# Altium project ARM_EURO_Platine.PrjPCB
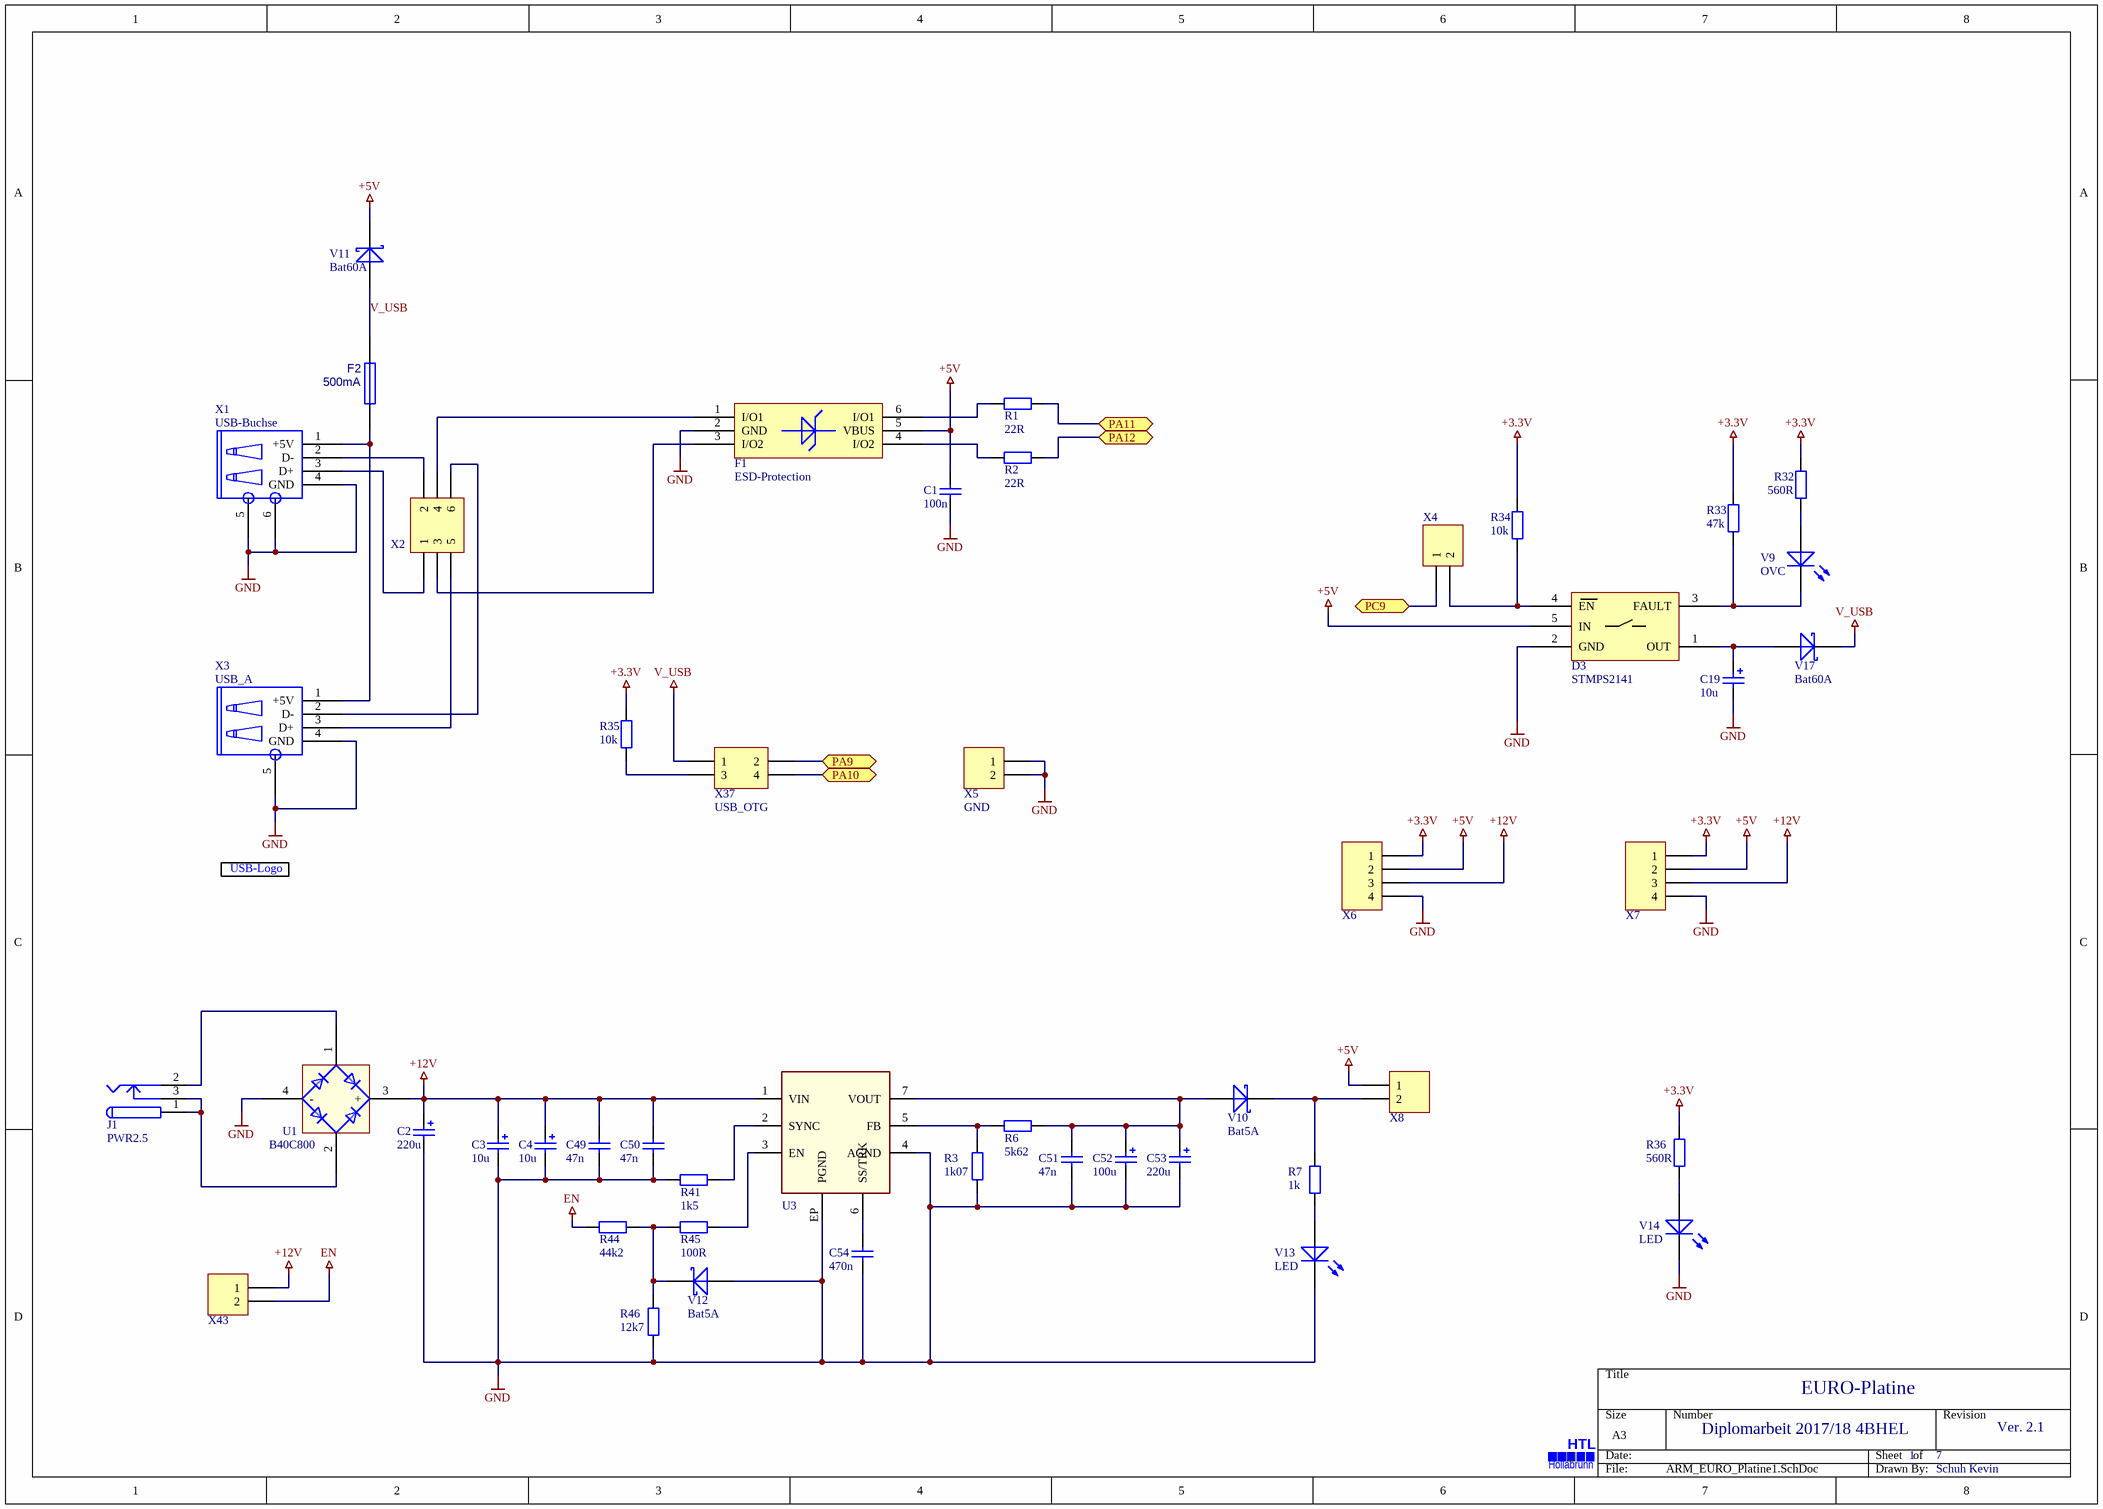
[diagram p0: ARM_EURO_Platine1.SchDoc]
7 sheets, 194 parts. Net scope: flat (ports and power ports of the same name join across sheets).
Board files: ARM_EURO_Platine.PcbDoc, PCB1.PcbDoc, PCB2.PcbDoc
Sheets:
  ARM_EURO_Platine1.SchDoc
  ARM_EURO_Platine2.SchDoc
  ARM_EURO_Platine3.SchDoc
  ARM_EURO_Platine4.SchDoc
  ARM_EURO_Platine5.SchDoc
  ARM_EURO_Platine6.SchDoc
  ARM_EURO_Platine7.SchDoc

## Sheet ARM_EURO_Platine1.SchDoc
size A3; PageSetup: Record=PageOptions|CenterHorizontal=True|CenterVertical=True|PrintScale=0.73|XCorrection=1.00|YCorrection=1.00|PrintKind=0|BorderSize=5000000|LeftOffset=0|BottomOffset=0|Orientation=2|PaperLength=1000|PaperWidth=1000|Scale=100|PaperSource=7|PrintQuality=-3|MediaType=1|DitherType=10|PrintScaleMode=1|PaperKind=A4|PaperIndex=9

### Parts
*1  USB_Logo  [USB_Logo]  (value not drawn)
A1  HTL Hollabrunn  [HTL_Logo]  (value not drawn)
C1  value 100n  [0805_CAP]  (hidden comment: Cap_Keramik_SMD)
C2  value 220u  [100µF_16V_Kondensator]  (hidden comment: Cap_Pol_SMD)
C3  value 10u  [1411_Cap_Pol_Tantal]  (hidden comment: Cap_Pol_Tantal)
C4  value 10u  [1411_Cap_Pol_Tantal]  (hidden comment: Cap_Pol_Tantal)
C19  value 10u  [100µF_16V_Kondensator]  (hidden comment: Cap_Pol_SMD)
C49  value 47n  [0805_CAP]  (hidden comment: Cap_Keramik_SMD)
C50  value 47n  [0805_CAP]  (hidden comment: Cap_Keramik_SMD)
C51  value 47n  [0805_CAP]  (hidden comment: Cap_Keramik_SMD)
C52  value 100u  [100µF_16V_Kondensator]  (hidden comment: Cap_Pol_SMD)
C53  value 220u  [100µF_16V_Kondensator]  (hidden comment: Cap_Pol_SMD)
C54  value 470n  [0805_CAP]  (hidden comment: Cap_Keramik_SMD)
D3  STMPS2141  [STMPS2141]
F1  ESD-Protection  [USBLC6_2]
F2  500mA  [Polyfuse]
J1  PWR2.5  [PowerJack]
R1  value 22R  [0805_Res]  (hidden comment: Res_SMD)
R2  value 22R  [0805_Res]  (hidden comment: Res_SMD)
R3  value 1k07  [0805_Res]  (hidden comment: Res_SMD)
R6  value 5k62  [0805_Res]  (hidden comment: Res_SMD)
R7  value 1k  [0805_Res]  (hidden comment: Res_SMD)
R32  value 560R  [0805_Res]  (hidden comment: Res_SMD)
R33  value 47k  [0805_Res]  (hidden comment: Res_SMD)
R34  value 10k  [0805_Res]  (hidden comment: Res_SMD)
R35  value 10k  [0805_Res]  (hidden comment: Res_SMD)
R36  value 560R  [0805_Res]  (hidden comment: Res_SMD)
R41  value 1k5  [0805_Res]  (hidden comment: Res_SMD)
R44  value 44k2  [0805_Res]  (hidden comment: Res_SMD)
R45  value 100R  [0805_Res]  (hidden comment: Res_SMD)
R46  value 12k7  [0805_Res]  (hidden comment: Res_SMD)
U1  B40C800  [Diodengleichrichter]
U3  171050601  [TO263-7EP]  (value not drawn)
V9  OVC  [0805_LED]
V10  Bat5A  [BAT254_Schottky]
V11  Bat60A  [BAT254_Schottky]
V12  Bat5A  [BAT254_Schottky]
V13  LED  [0805_LED]
V14  LED  [0805_LED]
V17  Bat60A  [BAT254_Schottky]
X1  USB-Buchse  [USB_B]
X2  Header_3x2  [HDR2X3]  (value not drawn)
X3  USB_A  [USB_A]
X4  Header  [HDR1X2]  (value not drawn)
X5  GND  [HDR1X2]
X6  Header_4  [HDR1X4]  (value not drawn)
X7  Header_4  [HDR1X4]  (value not drawn)
X8  Header  [HDR1X2]  (value not drawn)
X37  USB_OTG  [HDR2X2]
X43  Header  [HDR1X2]  (value not drawn)

### Ports
PA9, PA10, PA11, PA12, PC9

### Nets
+3.3V: R32.2 R33.2 R34.2 R35.2 R36.2 X6.1 X7.1
+5V: C1.2 D3.5(IN) F1.5(VBUS) V11.1 X6.2 X7.2 X8.1
+12V: C2.1 C3.1 C4.1 C49.2 C50.1 U1.3(+) U3.1(VIN) X6.3 X7.3 X43.1
EN: R44.2 X43.2
GND: C1.1 C2.2 C3.2 C4.2 C19.2 C49.1 C50.2 C51.2 C52.2 C53.2 C54.2 D3.2(GND) F1.2(GND) R3.1 R41.2 R46.1 U1.4(-) U3.4(AGND) U3.EP(PGND) V12.2 V13.2(K) V14.2(K) X1.4(GND) X1.5(GND) X1.6(GND) X3.4(GND) X3.5(GND) X5.1 X5.2 X6.4 X7.4
V_USB: F2.2 V11.2 V17.1 X37.1
NetC19_1: C19.1 D3.1(OUT) V17.2
NetC20_2: X37.4 ; port PA10
NetC22_2: X37.2 ; port PA9
NetC51_1: C51.1 C52.1 C53.1 R6.1 U3.7(VOUT) V10.2
NetC54_1: C54.1 U3.6(SS/TRK)
NetD3_3: D3.3(FAULT) R33.1 V9.2(K)
NetD3_4: D3.4(EN) R34.1 X4.2
NetF1_1: F1.1(I/O1) X2.4
NetF1_3: F1.3(I/O2) X2.3
NetF1_4: F1.4(I/O2) R2.1
NetF1_6: F1.6(I/O1) R1.1
NetF2_1: F2.1 X1.1(+5V) X3.1(+5V)
NetJ1_1: J1.1 J1.3 U1.2
NetJ1_2: J1.2 U1.1
NetR1_2: R1.2 ; port PA11
NetR2_2: R2.2 ; port PA12
NetR3_2: R3.2 R6.2 U3.5(FB)
NetR7_1: R7.1 V13.1(A)
NetR7_2: R7.2 V10.1 X8.2
NetR27_2: X4.1 ; port PC9
NetR32_1: R32.1 V9.1(A)
NetR35_1: R35.1 X37.3
NetR36_1: R36.1 V14.1(A)
NetR41_1: R41.1 U3.2(SYNC)
NetR44_1: R44.1 R45.2 R46.2 V12.1
NetR45_1: R45.1 U3.3(EN)
NetX1_2: X1.2(D-) X2.2
NetX1_3: X1.3(D+) X2.1
NetX2_5: X2.5 X3.3(D+)
NetX2_6: X2.6 X3.2(D-)

### Notes on the sheet
- EURO-Platine
- Diplomarbeit 2017/18 4BHEL
- 1
- 7
- Ver. 2.1
- Schuh Kevin
- (in symbol HTL_Logo) HTL; Hollabrunn
- (in symbol USB_Logo) USB-Logo

### Library data of the parts
*1 = USB_Logo: Logo
A1 = HTL_Logo
C1 C49-C51 C54 = Cap_Keramik_SMD: Capacitor_SMD; Published: 8-Jun-2000; LatestRevisionDate: 17-Jul-2002; LatestRevisionNote: Re-released for DXP Platform.; PackageReference: RAD-0.3; Publisher: Altium Limited
C2 C19 C52 C53 = Cap_Pol_SMD: Polarized Capacitor SMD; Published: 8-Jun-2000; LatestRevisionDate: 17-Jul-2002; LatestRevisionNote: Re-released for DXP Platform.; PackageReference: RB7.6-15; Publisher: Altium Limited
C3 C4 = Cap_Pol_Tantal: Polarized Capacitor; Published: 8-Jun-2000; LatestRevisionDate: 17-Jul-2002; LatestRevisionNote: Re-released for DXP Platform.; PackageReference: RB7.6-15; Publisher: Altium Limited
D3 = STMPS2141: Power Switch
F1 = USBLC6_2: Schutz vor entladungen über USB-Buchse
F2 = Fuse: Published: 8-Jun-2000; LatestRevisionDate: 17-Jul-2002; LatestRevisionNote: Re-released for DXP Platform.; PackageReference: PIN-W2/E2.8; Publisher: Altium Limited
J1 = PWR2.5: Low Voltage Power Supply Connector; Published: 17-Dec-2003; DatasheetDocument: 09-May-2002; Publisher: Altium Limited; ComponentLink1Description: Manufacturer Link; ComponentLink1URL: http://domino.kycon.com/internet/Products.html
R1-R3 R6 R7 R32-R36 R41 R44-R46 = Res_SMD: Resistor; Published: 8-Jun-2000; LatestRevisionDate: 17-Jul-2002; LatestRevisionNote: Re-released for DXP Platform.; PackageReference: AXIAL-0.4; Publisher: Altium Limited
U1 = Brueckengleichrichter
U3 = 171050601: VDRM Variable Step Down Regulator Module, TO263-7EP; OutputCurrent: 5A; InputVoltage: 6-36 V(DC); PublishedDate: Aug 2016; Publisher: Wurth Elektronik; ComponentLink1Description: Manufacturer; ComponentLink1URL: http://www.we-online.de; ComponentLink2Description: Datasheet; ComponentLink2URL: http://katalog.we-online.de/pm/datasheet/171050601.pdf; PartNumber: 171050601; Size: TO263-7EP
V9 V13 V14 = LED_SMD: Typical RED, GREEN, YELLOW, AMBER GaAs LED; Published: 8-Jun-2000; LatestRevisionDate: 17-Jul-2002; LatestRevisionNote: Re-released for DXP Platform.; PackageDocument: Feb-2002; PackageReference: 3.2X1.6X1.1; Publisher: Altium Limited
V10-V12 V17 = Bat60A: Diode
X1 = USB_Buchse_B: USB Buchse (B)
X2 = Header_3x2: Header, 3x2-Pin; LatestRevisionDate: 17-Jul-2002; LatestRevisionNote: Re-released for DXP Platform.; Publisher: Altium Limited
X3 = USB_Buchse_A: USB Buchse (A)
X4 X8 X43 = Header_2: Header, 2-Pin; LatestRevisionDate: 17-Jul-2002; LatestRevisionNote: Re-released for DXP Platform.; Publisher: Altium Limited
X5 = Masseschleife: Header, 2-Pin; LatestRevisionDate: 17-Jul-2002; LatestRevisionNote: Re-released for DXP Platform.; Publisher: Altium Limited
X6 X7 = Header_4: Header, 3-Pin; LatestRevisionDate: 17-Jul-2002; LatestRevisionNote: Re-released for DXP Platform.; Publisher: Altium Limited
X37 = Header_2x2: Header, 3x2-Pin; LatestRevisionDate: 17-Jul-2002; LatestRevisionNote: Re-released for DXP Platform.; Publisher: Altium Limited

## Sheet ARM_EURO_Platine2.SchDoc
size A4; PageSetup: Record=PageOptions|CenterHorizontal=True|CenterVertical=True|PrintScale=1.00|XCorrection=1.00|YCorrection=1.00|PrintKind=0|BorderSize=5000000|LeftOffset=0|BottomOffset=0|Orientation=2|PaperLength=1000|PaperWidth=1000|Scale=100|PaperSource=7|PrintQuality=-3|MediaType=1|DitherType=10|PrintScaleMode=1|PaperKind=A4|PaperIndex=9
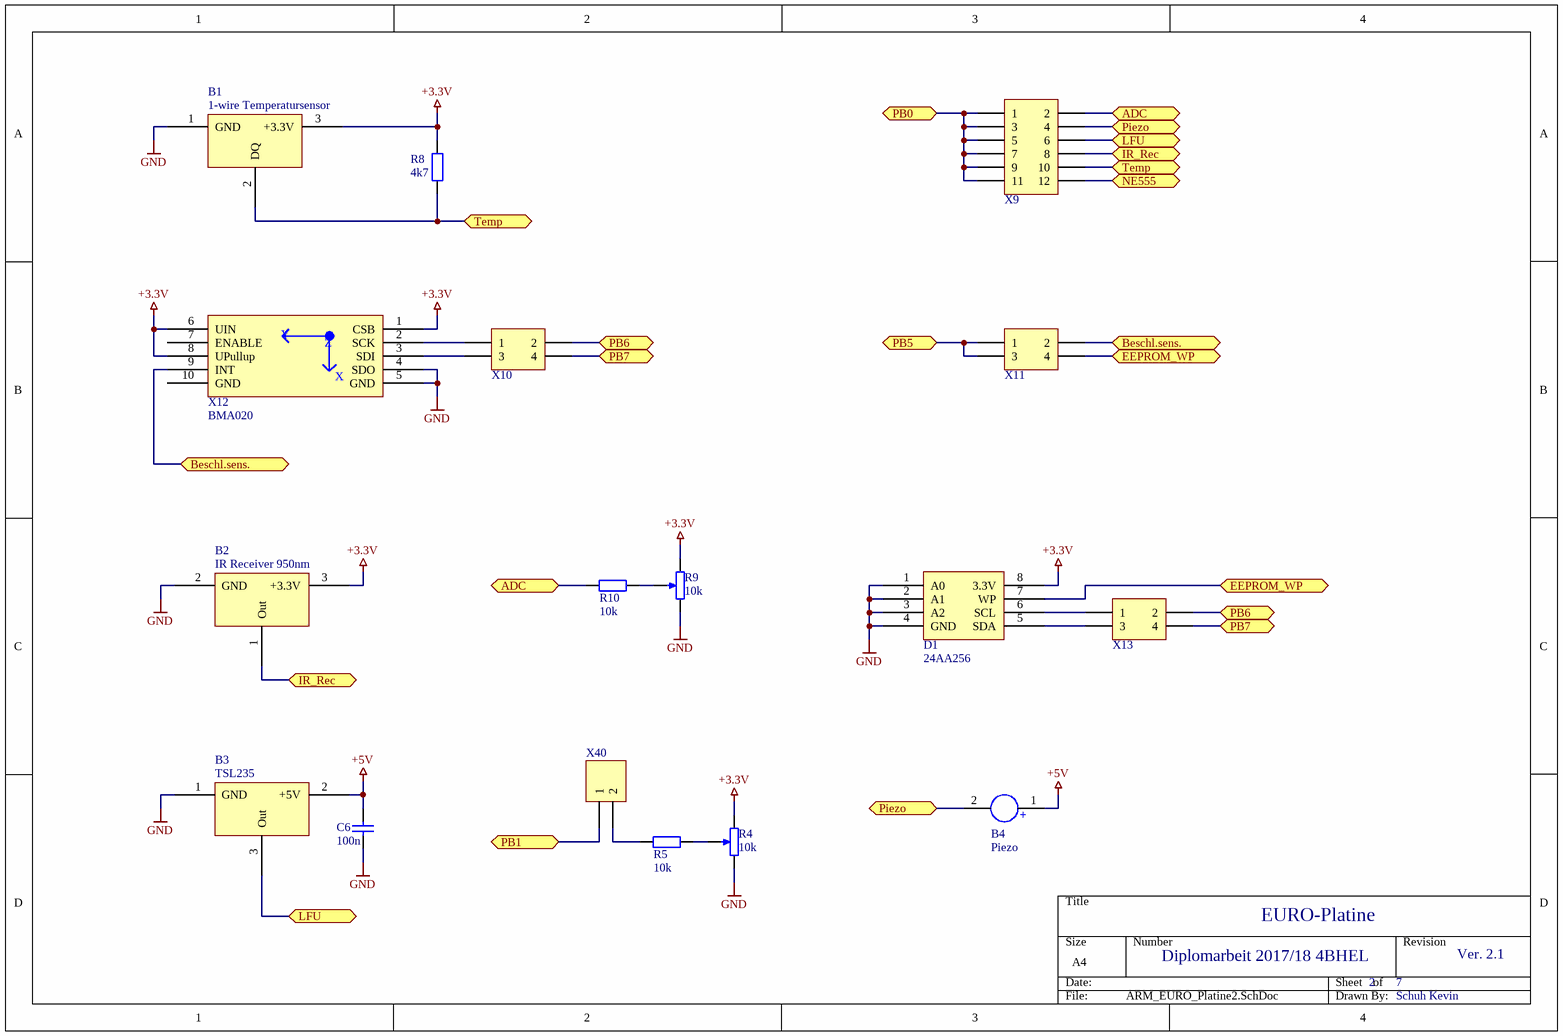
[diagram p1: ARM_EURO_Platine2.SchDoc]

### Parts
B1  1-wire Temperatursensor  [TO_92]
B2  IR Receiver 950nm  [TSOP341]
B3  TSL235  [LFU]
B4  Piezo  [Piezo]
C6  value 100n  [0805_CAP]  (hidden comment: Cap_Keramik_SMD)
D1  24AA256  [PDIP8]
R4  value 10k  [Potentiometer]  (hidden comment: RPot)
R5  value 10k  [0805_Res]  (hidden comment: Res_SMD)
R8  value 4k7  [0805_Res]  (hidden comment: Res_SMD)
R9  value 10k  [Potentiometer]  (hidden comment: RPot)
R10  value 10k  [0805_Res]  (hidden comment: Res_SMD)
X9  Header 6X2A  [HDR2X6]  (value not drawn)
X10  Header_2x2  [HDR2X2]  (value not drawn)
X11  Header_2x2  [HDR2X2]  (value not drawn)
X12  BMA020  [Beschleunigungssensor]
X13  Header_2x2  [HDR2X2]  (value not drawn)
X40  Header  [HDR1X2]  (value not drawn)

### Ports
ADC, Beschl.sens., EEPROM_WP, IR_Rec, LFU, NE555, PB0, PB1, PB5, PB6, PB7, Piezo, Temp

### Nets
+3.3V: B1.3(+3.3V) B2.3(+3.3V) D1.8(3.3V) R4.1(TOP) R8.2 R9.1(TOP) X12.1(CSB) X12.6(UIN) X12.8(UPullup)
+5V: B3.2(+5V) B4.1 C6.2
GND: B1.1(GND) B2.2(GND) B3.1(GND) C6.1 D1.1(A0) D1.2(A1) D1.3(A2) D1.4(GND) R4.2(BOT) R9.2(BOT) X12.4(SDO) X12.5(GND)
NetB1_2: B1.2(DQ) R8.1 X9.10 ; port Temp
NetB2_1: B2.1(Out) X9.8 ; port IR_Rec
NetB3_3: B3.3(Out) X9.6 ; port LFU
NetB4_2: B4.2 X9.4 ; port Piezo
NetD1_5: D1.5(SDA) X13.3
NetD1_6: D1.6(SCL) X13.1
NetD1_7: D1.7(WP) X11.4 ; port EEPROM_WP
NetD2_3: X9.12 ; port NE555
NetD4_9: X10.4 X13.4 ; port PB7
NetD4_11: X10.2 X13.2 ; port PB6
NetR4_3: R4.3(TAP) R5.1
NetR5_2: R5.2 X40.2
NetR9_3: R9.3(TAP) R10.1
NetR10_2: R10.2 X9.2 ; port ADC
NetX9_1: X9.1 X9.3 X9.5 X9.7 X9.9 X9.11 ; port PB0
NetX10_1: X10.1 X12.2(SCK)
NetX10_3: X10.3 X12.3(SDI)
NetX11_1: X11.1 X11.3 ; port PB5
NetX11_2: X11.2 X12.9(INT) ; port Beschl.sens.
NetX20_32: X40.1 ; port PB1

Not connected (* = marked no-connect by the designer): X12 7(ENABLE) 10(GND)

### Notes on the sheet
- EURO-Platine
- Diplomarbeit 2017/18 4BHEL
- 2
- 7
- Ver. 2.1
- Schuh Kevin
- (in symbol Beschleunigungssensor) Y; Z; X
- (in symbol Piezo) +

### Library data of the parts
B1 = DS18B20: Temperatursensor
B2 = IR_Receiver: IR-Empfänger; Anbieter: Farnell
B3 = LFU: Licht/Frequenz - Umwandler
B4 = Piezo: Signalgeber
C6 = Cap_Keramik_SMD: Capacitor_SMD; Published: 8-Jun-2000; LatestRevisionDate: 17-Jul-2002; LatestRevisionNote: Re-released for DXP Platform.; PackageReference: RAD-0.3; Publisher: Altium Limited
D1 = EEPROM: 32kx8 EEPROM
R4 R9 = RPot: Potentiometer; Sim Note: Enter the Resistance value and the set point into parameter fields.; Set Position: 0.5; Published: 8-Jun-2000; LatestRevisionDate: 17-Jul-2002; LatestRevisionNote: Re-released for DXP Platform.; PackageReference: VR5; Publisher: Altium Limited
R5 R8 R10 = Res_SMD: Resistor; Published: 8-Jun-2000; LatestRevisionDate: 17-Jul-2002; LatestRevisionNote: Re-released for DXP Platform.; PackageReference: AXIAL-0.4; Publisher: Altium Limited
X9 = Header_6X2A: Header, 6-Pin, Dual row; LatestRevisionDate: 17-Jul-2002; LatestRevisionNote: Re-released for DXP Platform.; Publisher: Altium Limited
X10 X11 X13 = Header_2x2: Header, 3x2-Pin; LatestRevisionDate: 17-Jul-2002; LatestRevisionNote: Re-released for DXP Platform.; Publisher: Altium Limited
X12 = Beschleunigungssensor: 3-Achsen Beschleunigungssensor-Modul; Hersteller: ELV Electronics
X40 = Header_2: Header, 2-Pin; LatestRevisionDate: 17-Jul-2002; LatestRevisionNote: Re-released for DXP Platform.; Publisher: Altium Limited

## Sheet ARM_EURO_Platine3.SchDoc
size A4; PageSetup: Record=PageOptions|CenterHorizontal=True|CenterVertical=True|PrintScale=1.00|XCorrection=1.00|YCorrection=1.00|PrintKind=0|BorderSize=5000000|LeftOffset=0|BottomOffset=0|Orientation=2|PaperLength=1000|PaperWidth=1000|Scale=100|PaperSource=7|PrintQuality=-3|MediaType=1|DitherType=10|PrintScaleMode=1|PaperKind=A4|PaperIndex=9
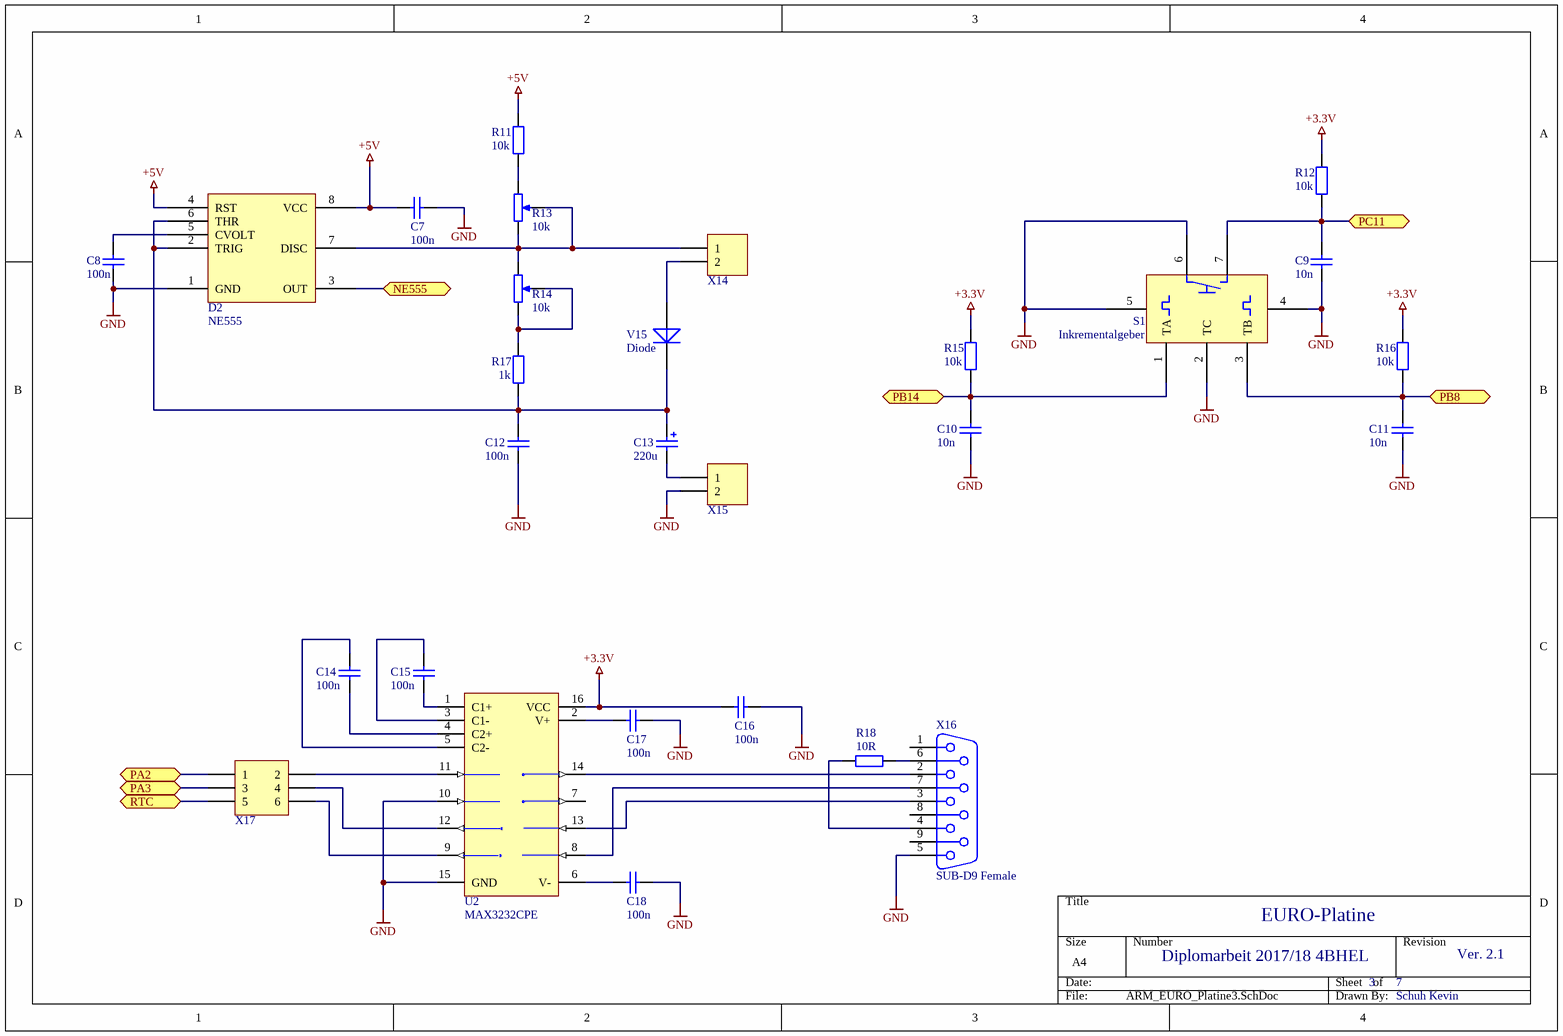
[diagram p2: ARM_EURO_Platine3.SchDoc]

### Parts
C7  value 100n  [0805_CAP]  (hidden comment: Cap_Keramik_SMD)
C8  value 100n  [0805_CAP]  (hidden comment: Cap_Keramik_SMD)
C9  value 10n  [0805_CAP]  (hidden comment: Cap_Keramik_SMD)
C10  value 10n  [0805_CAP]  (hidden comment: Cap_Keramik_SMD)
C11  value 10n  [0805_CAP]  (hidden comment: Cap_Keramik_SMD)
C12  value 100n  [0805_CAP]  (hidden comment: Cap_Keramik_SMD)
C13  value 220u  [100µF_16V_Kondensator]  (hidden comment: Cap_Pol_SMD)
C14  value 100n  [0805_CAP]  (hidden comment: Cap_Keramik_SMD)
C15  value 100n  [0805_CAP]  (hidden comment: Cap_Keramik_SMD)
C16  value 100n  [0805_CAP]  (hidden comment: Cap_Keramik_SMD)
C17  value 100n  [0805_CAP]  (hidden comment: Cap_Keramik_SMD)
C18  value 100n  [0805_CAP]  (hidden comment: Cap_Keramik_SMD)
D2  NE555  [PDIP8]
R11  value 10k  [0805_Res]  (hidden comment: Res_SMD)
R12  value 10k  [0805_Res]  (hidden comment: Res_SMD)
R13  value 10k  [Potentiometer]  (hidden comment: RPot)
R14  value 10k  [Potentiometer]  (hidden comment: RPot)
R15  value 10k  [0805_Res]  (hidden comment: Res_SMD)
R16  value 10k  [0805_Res]  (hidden comment: Res_SMD)
R17  value 1k  [0805_Res]  (hidden comment: Res_SMD)
R18  value 10R  [0805_Res]  (hidden comment: Res_SMD)
S1  Inkrementalgeber  [Inkrementalgeber]
U2  MAX3232CPE  [DIP_16]
V15  Diode  [Diode]
X14  Header  [HDR1X2]  (value not drawn)
X15  Header  [HDR1X2]  (value not drawn)
X16  SUB-D9 Female  [SUBD_9]
X17  Header_3x2  [HDR2X3]  (value not drawn)

### Ports
NE555, PA2, PA3, PB8, PB14, PC11, RTC

### Nets
+3.3V: C16.1 R12.1 R15.1 R16.1 U2.16(VCC)
+5V: C7.2 D2.4(RST) D2.8(VCC) R11.1
GND: C7.1 C8.2 C9.2 C10.2 C11.2 C12.2 C16.2 C17.2 C18.2 D2.1(GND) S1.2(TC) S1.4 S1.5 S1.6 U2.10(T2IN) U2.15(GND) X15.2 X16.5
NetC8_1: C8.1 D2.5(CVOLT)
NetC9_1: C9.1 R12.2 S1.7 ; port PC11
NetC10_1: C10.1 R15.2 S1.1(TA) ; port PB14
NetC11_1: C11.1 R16.2 S1.3(TB) ; port PB8
NetC12_1: C12.1 C13.1 D2.2(TRIG) D2.6(THR) R17.2 V15.2(K)
NetC13_2: C13.2 X15.1
NetC14_1: C14.1 U2.4(C2+)
NetC14_2: C14.2 U2.5(C2-)
NetC15_1: C15.1 U2.1(C1+)
NetC15_2: C15.2 U2.3(C1-)
NetC17_1: C17.1 U2.2(V+)
NetC18_1: C18.1 U2.6(V-)
NetC24_2: X17.3 ; port PA3
NetC26_2: X17.1 ; port PA2
NetD2_3: D2.3(OUT) ; port NE555
NetD2_7: D2.7(DISC) R13.2(BOT) R13.3(TAP) R14.1(TOP) X14.1
NetR11_2: R11.2 R13.1(TOP)
NetR14_2: R14.2(BOT) R14.3(TAP) R17.1
NetR18_1: R18.1 X16.4
NetR18_2: R18.2 X16.6
NetU2_8: U2.8(R2IN) X16.7
NetU2_9: U2.9(R2OUT) X17.6
NetU2_11: U2.11(T1IN) X17.2
NetU2_12: U2.12(R1OUT) X17.4
NetU2_13: U2.13(R1IN) X16.3
NetU2_14: U2.14(T1OUT) X16.2
NetV15_1: V15.1(A) X14.2
NetX17_5: X17.5 ; port RTC

Not connected (* = marked no-connect by the designer): U2 7(T2OUT); X16 1 8 9

### Notes on the sheet
- EURO-Platine
- Diplomarbeit 2017/18 4BHEL
- 3
- 7
- Ver. 2.1
- Schuh Kevin

### Library data of the parts
C7-C12 C14-C18 = Cap_Keramik_SMD: Capacitor_SMD; Published: 8-Jun-2000; LatestRevisionDate: 17-Jul-2002; LatestRevisionNote: Re-released for DXP Platform.; PackageReference: RAD-0.3; Publisher: Altium Limited
C13 = Cap_Pol_SMD: Polarized Capacitor SMD; Published: 8-Jun-2000; LatestRevisionDate: 17-Jul-2002; LatestRevisionNote: Re-released for DXP Platform.; PackageReference: RB7.6-15; Publisher: Altium Limited
R11 R12 R15-R18 = Res_SMD: Resistor; Published: 8-Jun-2000; LatestRevisionDate: 17-Jul-2002; LatestRevisionNote: Re-released for DXP Platform.; PackageReference: AXIAL-0.4; Publisher: Altium Limited
R13 R14 = RPot: as R4 on sheet ARM_EURO_Platine2; Published: 8-Jun-2000; LatestRevisionDate: 17-Jul-2002; LatestRevisionNote: Re-released for DXP Platform.; PackageReference: VR5; Publisher: Altium Limited
U2 = MAX3232CPE: 3.0V TO 5.5V, Low-Power, up to 1Mbps, True RS-232 Transceiver Using Four 0.1µF External Capacitor; Published: 16-Jan-2001; LatestRevisionDate: 06-Jun-2005; LatestRevisionNote: Stylized 3D Model Added.; DatasheetVersion: Mar-1999; PackageVersion: Aug-2000; PackageReference: PE16; Publisher: Altium Limited; PackageDescription: DIP; 16 Leads; Row Spacing 7.62 mm; Pitch 2.54 mm; Code_JEDEC: MS-001-BB; ComponentLink1Description: Manufacturer Link; ComponentLink1URL: http://www.maxim-ic.com/; ComponentLink2Description: Datasheet; ComponentLink2URL: http://pdfserv.maxim-ic.com/en/ds/MAX3222-MAX3241.pdf
V15 = Diode: Schottky Diode; Published: 8-Jun-2000; LatestRevisionDate: 17-Jul-2002; LatestRevisionNote: Re-released for DXP Platform.; PackageReference: SMB; Publisher: Altium Limited; Code_JEDEC: DO-214-AA
X14 X15 = Header_2: Header, 2-Pin; LatestRevisionDate: 17-Jul-2002; LatestRevisionNote: Re-released for DXP Platform.; Publisher: Altium Limited
X16 = SUB_D9: PackageDocument: O; Positions: 9; Gender: Receptacle; Published: 15-Jun-2001; LatestRevisionDate: 17-Jul-2002; LatestRevisionNote: Re-released for DXP Platform.; DatasheetDocument: 1-Sep-1999; PackageReference: 788750; Publisher: Altium Limited; Orientation: Right Angle
X17 = Header_3x2: Header, 3x2-Pin; LatestRevisionDate: 17-Jul-2002; LatestRevisionNote: Re-released for DXP Platform.; Publisher: Altium Limited

## Sheet ARM_EURO_Platine4.SchDoc
size A4; PageSetup: Record=PageOptions|CenterHorizontal=True|CenterVertical=True|PrintScale=1.00|XCorrection=1.00|YCorrection=1.00|PrintKind=0|BorderSize=5000000|LeftOffset=0|BottomOffset=0|Orientation=2|PaperLength=1000|PaperWidth=1000|Scale=100|PaperSource=7|PrintQuality=-3|MediaType=1|DitherType=10|PrintScaleMode=1|PaperKind=A4|PaperIndex=9
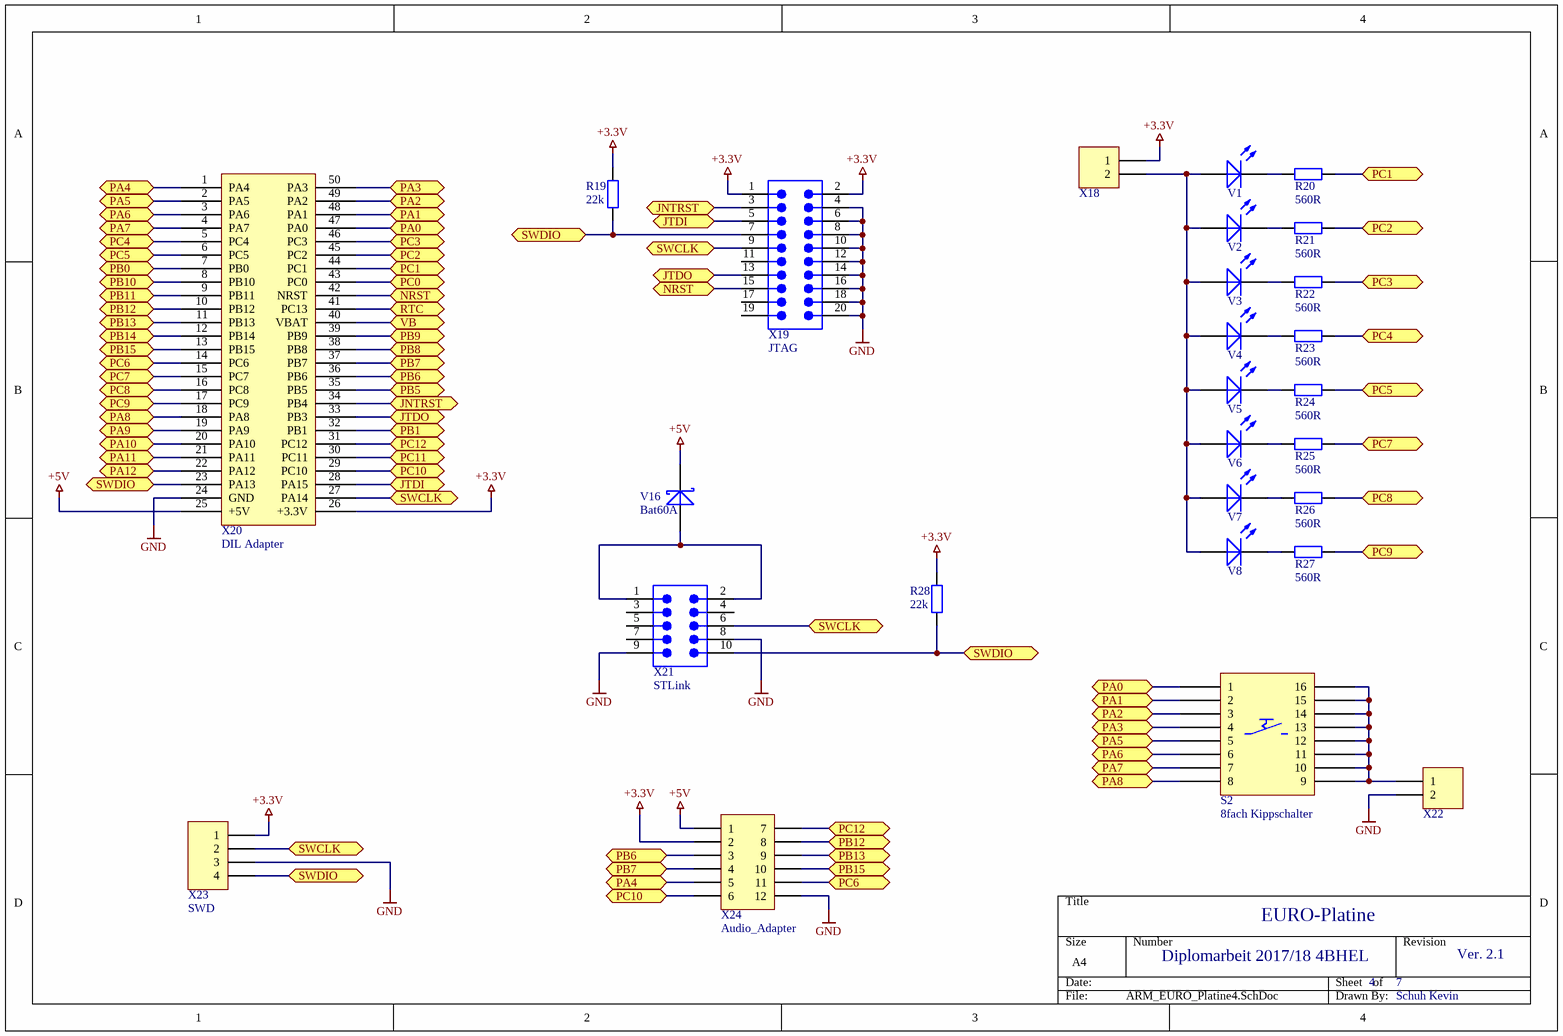
[diagram p3: ARM_EURO_Platine4.SchDoc]

### Parts
R19  value 22k  [0805_Res]  (hidden comment: Res_SMD)
R20  value 560R  [0805_Res]  (hidden comment: Res_SMD)
R21  value 560R  [0805_Res]  (hidden comment: Res_SMD)
R22  value 560R  [0805_Res]  (hidden comment: Res_SMD)
R23  value 560R  [0805_Res]  (hidden comment: Res_SMD)
R24  value 560R  [0805_Res]  (hidden comment: Res_SMD)
R25  value 560R  [0805_Res]  (hidden comment: Res_SMD)
R26  value 560R  [0805_Res]  (hidden comment: Res_SMD)
R27  value 560R  [0805_Res]  (hidden comment: Res_SMD)
R28  value 22k  [0805_Res]  (hidden comment: Res_SMD)
S2  8fach Kippschalter  [DIP_16]
V1  LED  [0805_LED]  (value not drawn)
V2  LED  [0805_LED]  (value not drawn)
V3  LED  [0805_LED]  (value not drawn)
V4  LED  [0805_LED]  (value not drawn)
V5  LED  [0805_LED]  (value not drawn)
V6  LED  [0805_LED]  (value not drawn)
V7  LED  [0805_LED]  (value not drawn)
V8  LED  [0805_LED]  (value not drawn)
V16  Bat60A  [BAT254_Schottky]
X18  Header  [HDR1X2]  (value not drawn)
X19  JTAG  [JTAG_90Grad]
X20  DIL Adapter  [DIL_Adapter_V03]
X21  STLink  [STLink]
X22  Header  [HDR1X2]  (value not drawn)
X23  SWD  [HDR1X4_SWD]
X24  Audio_Adapter  [AUDIO_ADAPTER]

### Ports
JNTRST, JTDI, JTDO, NRST, PA0, PA1, PA2, PA3, PA4, PA5, PA6, PA7, PA8, PA9, PA10, PA11, PA12, PB0, PB1, PB5, PB6, PB7, PB8, PB9, PB10, PB11, PB12, PB13, PB14, PB15, PC0, PC1, PC2, PC3, PC4, PC5, PC6, PC7, PC8, PC9, PC10, PC11, PC12, RTC, SWCLK, SWDIO, VB

### Nets
+3.3V: R19.2 R28.2 X18.1 X19.1 X19.2 X20.26(+3.3V) X23.1 X24.2
+5V: V16.1 X20.25(+5V) X24.1
GND: X19.4 X19.6 X19.8 X19.10 X19.12 X19.14 X19.16 X19.18 X19.20 X20.24(GND) X21.8 X21.9 X22.2 X23.3 X24.12
NetC9_1: X20.30(PC11) ; port PC11
NetC10_1: X20.12(PB14) ; port PB14
NetC11_1: X20.38(PB8) ; port PB8
NetC20_2: X20.20(PA10) ; port PA10
NetC22_2: X20.19(PA9) ; port PA9
NetC24_2: S2.4 X20.50(PA3) ; port PA3
NetC26_2: S2.3 X20.49(PA2) ; port PA2
NetD4_9: X20.37(PB7) X24.4 ; port PB7
NetD4_11: X20.36(PB6) X24.3 ; port PB6
NetR1_2: X20.21(PA11) ; port PA11
NetR2_2: X20.22(PA12) ; port PA12
NetR19_1: R19.1 R28.1 X19.7 X20.23(PA13) X21.10 X23.4 ; port SWDIO
NetR20_1: R20.1 V1.2(K)
NetR20_2: R20.2 X20.44(PC1) ; port PC1
NetR21_1: R21.1 V2.2(K)
NetR21_2: R21.2 X20.45(PC2) ; port PC2
NetR22_1: R22.1 V3.2(K)
NetR22_2: R22.2 X20.46(PC3) ; port PC3
NetR23_1: R23.1 V4.2(K)
NetR23_2: R23.2 X20.5(PC4) ; port PC4
NetR24_1: R24.1 V5.2(K)
NetR24_2: R24.2 X20.6(PC5) ; port PC5
NetR25_1: R25.1 V6.2(K)
NetR25_2: R25.2 X20.15(PC7) ; port PC7
NetR26_1: R26.1 V7.2(K)
NetR26_2: R26.2 X20.16(PC8) ; port PC8
NetR27_1: R27.1 V8.2(K)
NetR27_2: R27.2 X20.17(PC9) ; port PC9
NetR47_1: X20.10(PB12) X24.8 ; port PB12
NetR48_1: X20.13(PB15) X24.10 ; port PB15
NetS2_1: S2.1 X20.47(PA0) ; port PA0
NetS2_2: S2.2 X20.48(PA1) ; port PA1
NetS2_5: S2.5 X20.2(PA5) ; port PA5
NetS2_6: S2.6 X20.3(PA6) ; port PA6
NetS2_7: S2.7 X20.4(PA7) ; port PA7
NetS2_8: S2.8 X20.18(PA8) ; port PA8
NetS2_9: S2.9 S2.10 S2.11 S2.12 S2.13 S2.14 S2.15 S2.16 X22.1
NetV1_1: V1.1(A) V2.1(A) V3.1(A) V4.1(A) V5.1(A) V6.1(A) V7.1(A) V8.1(A) X18.2
NetV16_2: V16.2 X21.1 X21.2
NetX9_1: X20.7(PB0) ; port PB0
NetX11_1: X20.35(PB5) ; port PB5
NetX17_5: X20.41(PC13) ; port RTC
NetX19_3: X19.3 X20.34(PB4) ; port JNTRST
NetX19_5: X19.5 X20.28(PA15) ; port JTDI
NetX19_9: X19.9 X20.27(PA14) X21.6 X23.2 ; port SWCLK
NetX19_13: X19.13 X20.33(PB3) ; port JTDO
NetX19_15: X19.15 X20.42(NRST) ; port NRST
NetX20_1: X20.1(PA4) X24.5 ; port PA4
NetX20_8: X20.8(PB10) ; port PB10
NetX20_9: X20.9(PB11) ; port PB11
NetX20_11: X20.11(PB13) X24.9 ; port PB13
NetX20_14: X20.14(PC6) X24.11 ; port PC6
NetX20_29: X20.29(PC10) X24.6 ; port PC10
NetX20_31: X20.31(PC12) X24.7 ; port PC12
NetX20_32: X20.32(PB1) ; port PB1
NetX20_39: X20.39(PB9) ; port PB9
NetX20_40: X20.40(VBAT) ; port VB
NetX20_43: X20.43(PC0) ; port PC0

Not connected (* = marked no-connect by the designer): X19 11 17 19; X21 3 4 5 7

### Notes on the sheet
- EURO-Platine
- Diplomarbeit 2017/18 4BHEL
- 4
- 7
- Ver. 2.1
- Schuh Kevin

### Library data of the parts
R19-R28 = Res_SMD: Resistor; Published: 8-Jun-2000; LatestRevisionDate: 17-Jul-2002; LatestRevisionNote: Re-released for DXP Platform.; PackageReference: AXIAL-0.4; Publisher: Altium Limited
S2 = Kippschalter_8fach
V1-V8 = LED_SMD: as V9 on sheet ARM_EURO_Platine1; Published: 8-Jun-2000; LatestRevisionDate: 17-Jul-2002; LatestRevisionNote: Re-released for DXP Platform.; PackageDocument: Feb-2002; PackageReference: 3.2X1.6X1.1; Publisher: Altium Limited
V16 = Bat60A: Diode
X18 X22 = Header_2: Header, 2-Pin; LatestRevisionDate: 17-Jul-2002; LatestRevisionNote: Re-released for DXP Platform.; Publisher: Altium Limited
X19 = JTAG: Flat Cable Connector (IDC), Low-Profile Male Header, Straight Solder Pin, 20 Contacts, Performance Level 2; PCB_Layout: Complies with manufacturer's recommendation.; DrillSize: Corresponds to nominal value.; Published: 15-Nov-2004; DatasheetDocument: Sep-2003; PackageDocument: 01-Feb-2000; PackageReference: 918520x324; Publisher: Altium Limited; ComponentLink1Description: Manufacturer Link; ComponentLink1URL: http://www.harting.com/; ComponentLink2Description: Selection Guide; ComponentLink2URL: http://www.harting.com/imperia/md/content/steckverbinderundsystemkomponenten/folder/interface_engl_chapter_09.pdf
X20 = DIL_Adapter_V03: DIL Adapter 50 Pin
X21 = STLink: Flat Cable Connector (IDC), Low-Profile Male Header, Straight Solder Pin, 20 Contacts, Performance Level 2; PCB_Layout: Complies with manufacturer's recommendation.; DrillSize: Corresponds to nominal value.; Published: 15-Nov-2004; DatasheetDocument: Sep-2003; PackageDocument: 01-Feb-2000; PackageReference: 918520x324; Publisher: Altium Limited; ComponentLink1Description: Manufacturer Link; ComponentLink1URL: http://www.harting.com/; ComponentLink2Description: Selection Guide; ComponentLink2URL: http://www.harting.com/imperia/md/content/steckverbinderundsystemkomponenten/folder/interface_engl_chapter_09.pdf
X23 = SWD: Header, 4-Pin; LatestRevisionDate: 17-Jul-2002; LatestRevisionNote: Re-released for DXP Platform.; Publisher: Altium Limited
X24 = Audio_Adapter: Header, 6-Pin, Dual row; LatestRevisionDate: 17-Jul-2002; LatestRevisionNote: Re-released for DXP Platform.; Publisher: Altium Limited

## Sheet ARM_EURO_Platine5.SchDoc
size A4; PageSetup: Record=PageOptions|CenterHorizontal=True|CenterVertical=True|PrintScale=1.00|XCorrection=1.00|YCorrection=1.00|PrintKind=0|BorderSize=5000000|LeftOffset=0|BottomOffset=0|Orientation=2|PaperLength=1000|PaperWidth=1000|Scale=100|PaperSource=7|PrintQuality=-3|MediaType=1|DitherType=10|PrintScaleMode=1|PaperKind=A4|PaperIndex=9
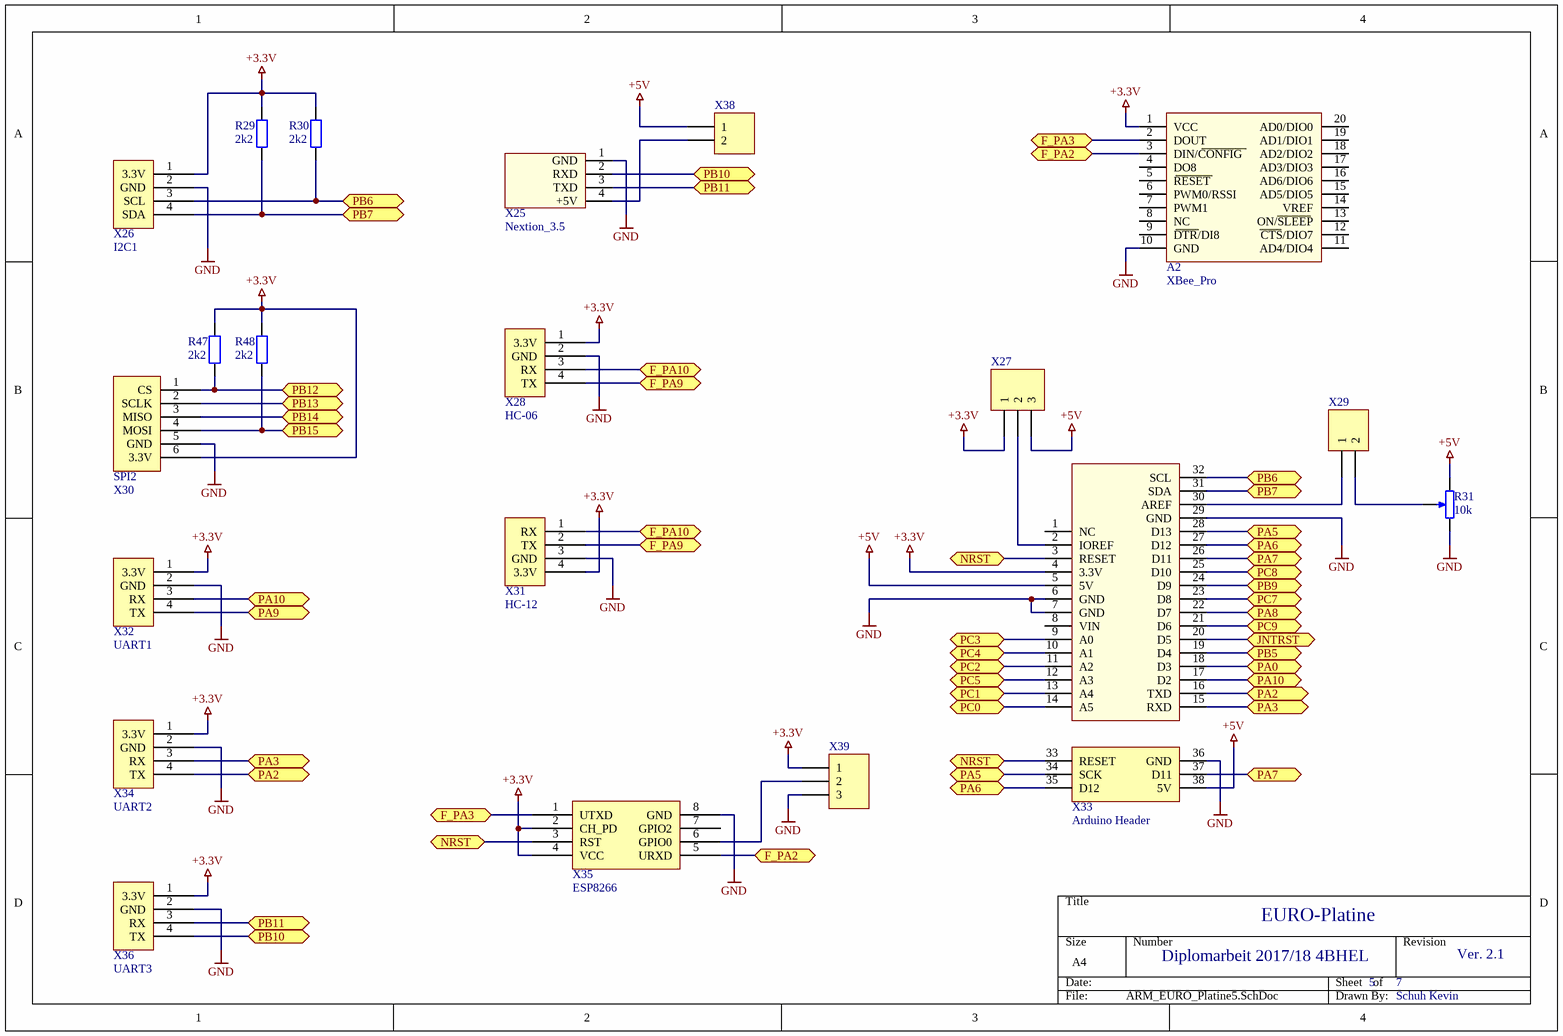
[diagram p4: ARM_EURO_Platine5.SchDoc]

### Parts
A2  XBee_Pro  [XBee_Pro]
R29  value 2k2  [0805_Res]  (hidden comment: Res_SMD)
R30  value 2k2  [0805_Res]  (hidden comment: Res_SMD)
R31  value 10k  [Potentiometer]  (hidden comment: RPot)
R47  value 2k2  [0805_Res]  (hidden comment: Res_SMD)
R48  value 2k2  [0805_Res]  (hidden comment: Res_SMD)
X25  Nextion_3.5  [Nextion_3.5]
X26  I2C1  [I2C_Interface]
X27  Header_3  [HDR1X3]  (value not drawn)
X28  HC-06  [HC_06]
X29  Header  [HDR1X2]  (value not drawn)
X30  SPI2  [SPI_Interface]
X31  HC-12  [HC_12]
X32  UART1  [UART_Interface]
X33  Arduino Header  [Arduino]
X34  UART2  [UART_Interface]
X35  ESP8266  [ESP8266]
X36  UART3  [UART_Interface]
X38  Header  [HDR1X2]  (value not drawn)
X39  Header_3  [HDR1X3]  (value not drawn)

### Ports
F_PA2, F_PA3, F_PA9, F_PA10, JNTRST, NRST, PA0, PA2, PA3, PA5, PA6, PA7, PA8, PA9, PA10, PB5, PB6, PB7, PB9, PB10, PB11, PB12, PB13, PB14, PB15, PC0, PC1, PC2, PC3, PC4, PC5, PC7, PC8, PC9

### Nets
+3.3V: A2.1(VCC) R29.2 R30.2 R47.2 R48.2 X26.1(3.3V) X27.1 X28.1(3.3V) X30.6(3.3V) X31.4(3.3V) X32.1(3.3V) X33.4(3.3V) X34.1(3.3V) X35.2(CH_PD) X35.4(VCC) X36.1(3.3V) X39.1
+5V: R31.1(TOP) X27.3 X33.5(5V) X33.38(5V) X38.1
GND: A2.10(GND) R31.2(BOT) X25.1(GND) X26.2(GND) X28.2(GND) X30.5(GND) X31.3(GND) X32.2(GND) X33.6(GND) X33.7(GND) X33.29(GND) X33.36(GND) X34.2(GND) X35.8(GND) X36.2(GND) X39.3
NetA2_2: A2.2(DOUT) X35.1(UTXD) ; port F_PA3
NetA2_3: A2.3(DIN/CONFIG) X35.5(URXD) ; port F_PA2
NetC5_2: X28.3(RX) X31.1(RX) ; port F_PA10
NetC10_1: X30.3(MISO) ; port PB14
NetC20_2: X32.3(RX) X33.17(D2) ; port PA10
NetC21_2: X28.4(TX) X31.2(TX) ; port F_PA9
NetC22_2: X32.4(TX) ; port PA9
NetC24_2: X33.15(RXD) X34.3(RX) ; port PA3
NetC26_2: X33.16(TXD) X34.4(TX) ; port PA2
NetD4_9: R29.1 X26.4(SDA) X33.31(SDA) ; port PB7
NetD4_11: R30.1 X26.3(SCL) X33.32(SCL) ; port PB6
NetR20_2: X33.13(A4) ; port PC1
NetR21_2: X33.11(A2) ; port PC2
NetR22_2: X33.9(A0) ; port PC3
NetR23_2: X33.10(A1) ; port PC4
NetR24_2: X33.12(A3) ; port PC5
NetR25_2: X33.23(D8) ; port PC7
NetR26_2: X33.25(D10) ; port PC8
NetR27_2: X33.21(D6) ; port PC9
NetR31_3: R31.3(TAP) X29.2
NetR47_1: R47.1 X30.1(CS) ; port PB12
NetR48_1: R48.1 X30.4(MOSI) ; port PB15
NetS2_1: X33.18(D3) ; port PA0
NetS2_5: X33.28(D13) X33.34(SCK) ; port PA5
NetS2_6: X33.27(D12) X33.35(D12) ; port PA6
NetS2_7: X33.26(D11) X33.37(D11) ; port PA7
NetS2_8: X33.22(D7) ; port PA8
NetX11_1: X33.19(D4) ; port PB5
NetX19_3: X33.20(D5) ; port JNTRST
NetX19_15: X33.3(RESET) X33.33(RESET) X35.3(RST) ; port NRST
NetX20_8: X25.2(RXD) X36.4(TX) ; port PB10
NetX20_9: X25.3(TXD) X36.3(RX) ; port PB11
NetX20_11: X30.2(SCLK) ; port PB13
NetX20_39: X33.24(D9) ; port PB9
NetX20_43: X33.14(A5) ; port PC0
NetX25_4: X25.4(+5V) X38.2
NetX27_2: X27.2 X33.2(IOREF)
NetX29_1: X29.1 X33.30(AREF)
NetX35_6: X35.6(GPIO0) X39.2

Not connected (* = marked no-connect by the designer): A2 4(DO8) 5(RESET) 6(PWM0/RSSI) 7(PWM1) 8(NC) 9(DTR/DI8) 11(AD4/DIO4) 12(CTS/DIO7) 13(ON/SLEEP) 14(VREF) 15(AD5/DIO5) 16(AD6/DIO6) 17(AD3/DIO3) 18(AD2/DIO2) 19(AD1/DIO1) 20(AD0/DIO0); X33 1(NC) 8(VIN); X35 7(GPIO2)

### Notes on the sheet
- EURO-Platine
- Diplomarbeit 2017/18 4BHEL
- 5
- 7
- Ver. 2.1
- Schuh Kevin

### Library data of the parts
A2 = XBee_Pro: Funkmodul
R29 R30 R47 R48 = Res_SMD: Resistor; Published: 8-Jun-2000; LatestRevisionDate: 17-Jul-2002; LatestRevisionNote: Re-released for DXP Platform.; PackageReference: AXIAL-0.4; Publisher: Altium Limited
R31 = RPot: as R4 on sheet ARM_EURO_Platine2; Published: 8-Jun-2000; LatestRevisionDate: 17-Jul-2002; LatestRevisionNote: Re-released for DXP Platform.; PackageReference: VR5; Publisher: Altium Limited
X26 = I2C_Interface: Stiftleiste 4Pol
X27 X39 = Header_3: Header, 3-Pin; LatestRevisionDate: 17-Jul-2002; LatestRevisionNote: Re-released for DXP Platform.; Publisher: Altium Limited
X28 = HC_06: Stiftleiste 4Pol
X29 X38 = Header_2: Header, 2-Pin; LatestRevisionDate: 17-Jul-2002; LatestRevisionNote: Re-released for DXP Platform.; Publisher: Altium Limited
X30 = SPI_Interface: Stiftleiste 6Pol
X31 = HC_12
X32 X34 X36 = UART_Interface: Stiftleiste 4Pol
X33 = Arduino
X35 = ESP8266: W-LAN Modul

## Sheet ARM_EURO_Platine6.SchDoc
size A4; PageSetup: Record=PageOptions|CenterHorizontal=True|CenterVertical=True|PrintScale=1.00|XCorrection=1.00|YCorrection=1.00|PrintKind=0|BorderSize=5000000|LeftOffset=0|BottomOffset=0|Orientation=2|PaperLength=1000|PaperWidth=1000|Scale=100|PaperSource=7|PrintQuality=-3|MediaType=1|DitherType=10|PrintScaleMode=1|PaperKind=A4|PaperIndex=9
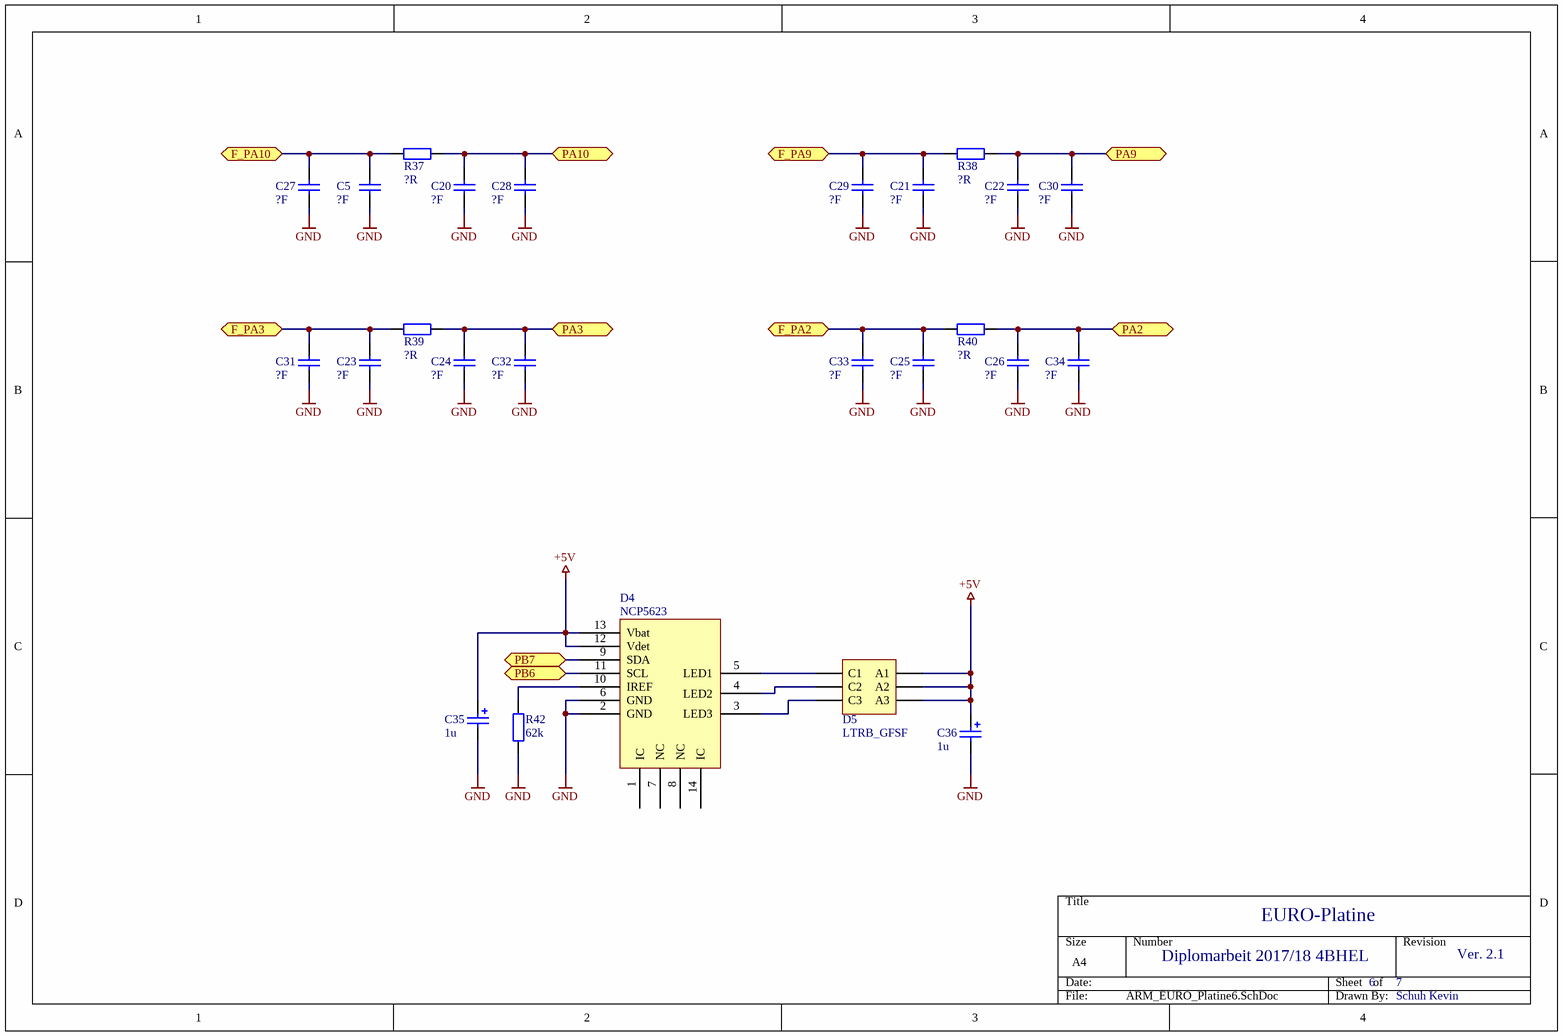
[diagram p5: ARM_EURO_Platine6.SchDoc]

### Parts
C5  value ?F  [0603_CAP]  (hidden comment: Cap_Keramik_SMD)
C20  value ?F  [0603_CAP]  (hidden comment: Cap_Keramik_SMD)
C21  value ?F  [0603_CAP]  (hidden comment: Cap_Keramik_SMD)
C22  value ?F  [0603_CAP]  (hidden comment: Cap_Keramik_SMD)
C23  value ?F  [0603_CAP]  (hidden comment: Cap_Keramik_SMD)
C24  value ?F  [0603_CAP]  (hidden comment: Cap_Keramik_SMD)
C25  value ?F  [0603_CAP]  (hidden comment: Cap_Keramik_SMD)
C26  value ?F  [0603_CAP]  (hidden comment: Cap_Keramik_SMD)
C27  value ?F  [0603_CAP]  (hidden comment: Cap_Keramik_SMD)
C28  value ?F  [0603_CAP]  (hidden comment: Cap_Keramik_SMD)
C29  value ?F  [0603_CAP]  (hidden comment: Cap_Keramik_SMD)
C30  value ?F  [0603_CAP]  (hidden comment: Cap_Keramik_SMD)
C31  value ?F  [0603_CAP]  (hidden comment: Cap_Keramik_SMD)
C32  value ?F  [0603_CAP]  (hidden comment: Cap_Keramik_SMD)
C33  value ?F  [0603_CAP]  (hidden comment: Cap_Keramik_SMD)
C34  value ?F  [0603_CAP]  (hidden comment: Cap_Keramik_SMD)
C35  value 1u  [1411_Cap_Pol_Tantal]  (hidden comment: Cap_Pol_Tantal)
C36  value 1u  [1411_Cap_Pol_Tantal]  (hidden comment: Cap_Pol_Tantal)
D4  NCP5623  [NCP5623]
D5  LTRB_GFSF  [LTRB_GFSF]
R37  value ?R  [0603_Res]  (hidden comment: Res_SMD)
R38  value ?R  [0603_Res]  (hidden comment: Res_SMD)
R39  value ?R  [0603_Res]  (hidden comment: Res_SMD)
R40  value ?R  [0603_Res]  (hidden comment: Res_SMD)
R42  value 62k  [0805_Res]  (hidden comment: Res_SMD)

### Ports
F_PA2, F_PA3, F_PA9, F_PA10, PA2, PA3, PA9, PA10, PB6, PB7

### Nets
+5V: C35.1 C36.1 D4.12(Vdet) D4.13(Vbat) D5.4(A3) D5.5(A2) D5.6(A1)
GND: C5.1 C20.1 C21.1 C22.1 C23.1 C24.1 C25.1 C26.1 C27.1 C28.1 C29.1 C30.1 C31.1 C32.1 C33.1 C34.1 C35.2 C36.2 D4.2(GND) D4.6(GND) R42.1
NetA2_2: C23.2 C31.2 R39.1 ; port F_PA3
NetA2_3: C25.2 C33.2 R40.1 ; port F_PA2
NetC5_2: C5.2 C27.2 R37.1 ; port F_PA10
NetC20_2: C20.2 C28.2 R37.2 ; port PA10
NetC21_2: C21.2 C29.2 R38.1 ; port F_PA9
NetC22_2: C22.2 C30.2 R38.2 ; port PA9
NetC24_2: C24.2 C32.2 R39.2 ; port PA3
NetC26_2: C26.2 C34.2 R40.2 ; port PA2
NetD4_3: D4.3(LED3) D5.3(C3)
NetD4_4: D4.4(LED2) D5.2(C2)
NetD4_5: D4.5(LED1) D5.1(C1)
NetD4_9: D4.9(SDA) ; port PB7
NetD4_10: D4.10(IREF) R42.2
NetD4_11: D4.11(SCL) ; port PB6

Not connected (* = marked no-connect by the designer): D4 1(IC) 7(NC) 8(NC) 14(IC)

### Notes on the sheet
- EURO-Platine
- Diplomarbeit 2017/18 4BHEL
- 6
- 7
- Ver. 2.1
- Schuh Kevin

### Library data of the parts
C5 C20-C34 = Cap_Keramik_SMD: Capacitor_SMD; Published: 8-Jun-2000; LatestRevisionDate: 17-Jul-2002; LatestRevisionNote: Re-released for DXP Platform.; PackageReference: RAD-0.3; Publisher: Altium Limited
C35 C36 = Cap_Pol_Tantal: Polarized Capacitor; Published: 8-Jun-2000; LatestRevisionDate: 17-Jul-2002; LatestRevisionNote: Re-released for DXP Platform.; PackageReference: RB7.6-15; Publisher: Altium Limited
D5 = LTRB_GFSF: LTRB-GFSF; LatestRevisionDate: 17-Jul-2002; LatestRevisionNote: Re-released for DXP Platform.; Publisher: Altium Limited
R37-R40 R42 = Res_SMD: Resistor; Published: 8-Jun-2000; LatestRevisionDate: 17-Jul-2002; LatestRevisionNote: Re-released for DXP Platform.; PackageReference: AXIAL-0.4; Publisher: Altium Limited

## Sheet ARM_EURO_Platine7.SchDoc
size A4; PageSetup: Record=PageOptions|CenterHorizontal=True|CenterVertical=True|PrintScale=1.00|XCorrection=1.00|YCorrection=1.00|PrintKind=0|BorderSize=5000000|LeftOffset=0|BottomOffset=0|Orientation=2|PaperLength=1000|PaperWidth=1000|Scale=100|PaperSource=7|PrintQuality=-3|MediaType=1|DitherType=10|PrintScaleMode=1|PaperKind=A4|PaperIndex=9
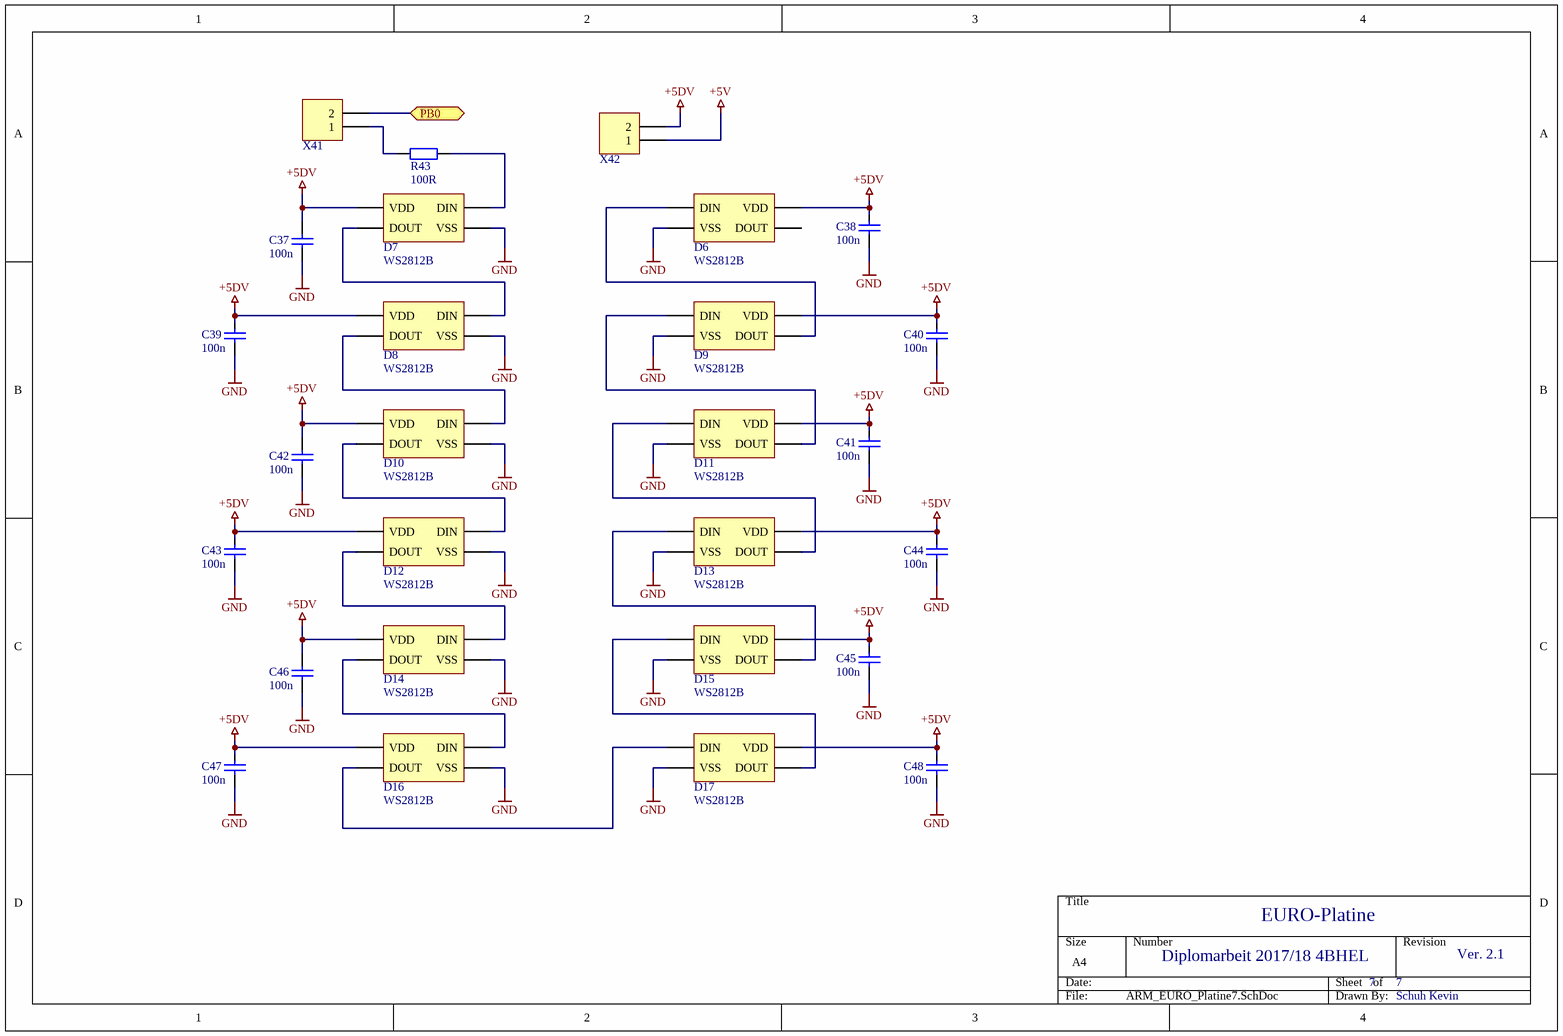
[diagram p6: ARM_EURO_Platine7.SchDoc]

### Parts
C37  value 100n  [0805_CAP]  (hidden comment: Cap_Keramik_SMD)
C38  value 100n  [0805_CAP]  (hidden comment: Cap_Keramik_SMD)
C39  value 100n  [0805_CAP]  (hidden comment: Cap_Keramik_SMD)
C40  value 100n  [0805_CAP]  (hidden comment: Cap_Keramik_SMD)
C41  value 100n  [0805_CAP]  (hidden comment: Cap_Keramik_SMD)
C42  value 100n  [0805_CAP]  (hidden comment: Cap_Keramik_SMD)
C43  value 100n  [0805_CAP]  (hidden comment: Cap_Keramik_SMD)
C44  value 100n  [0805_CAP]  (hidden comment: Cap_Keramik_SMD)
C45  value 100n  [0805_CAP]  (hidden comment: Cap_Keramik_SMD)
C46  value 100n  [0805_CAP]  (hidden comment: Cap_Keramik_SMD)
C47  value 100n  [0805_CAP]  (hidden comment: Cap_Keramik_SMD)
C48  value 100n  [0805_CAP]  (hidden comment: Cap_Keramik_SMD)
D6  WS2812B  [WS2812B]
D7  WS2812B  [WS2812B]
D8  WS2812B  [WS2812B]
D9  WS2812B  [WS2812B]
D10  WS2812B  [WS2812B]
D11  WS2812B  [WS2812B]
D12  WS2812B  [WS2812B]
D13  WS2812B  [WS2812B]
D14  WS2812B  [WS2812B]
D15  WS2812B  [WS2812B]
D16  WS2812B  [WS2812B]
D17  WS2812B  [WS2812B]
R43  value 100R  [0805_Res]  (hidden comment: Res_SMD)
X41  Header  [HDR1X2]  (value not drawn)
X42  Header  [HDR1X2]  (value not drawn)

### Ports
PB0

### Nets
+5DV: C37.2 C38.2 C39.2 C40.2 C41.2 C42.2 C43.2 C44.2 C45.2 C46.2 C47.2 C48.2 D6.1(VDD) D7.1(VDD) D8.1(VDD) D9.1(VDD) D10.1(VDD) D11.1(VDD) D12.1(VDD) D13.1(VDD) D14.1(VDD) D15.1(VDD) D16.1(VDD) D17.1(VDD) X42.2
+5V: X42.1
GND: C37.1 C38.1 C39.1 C40.1 C41.1 C42.1 C43.1 C44.1 C45.1 C46.1 C47.1 C48.1 D6.3(VSS) D7.3(VSS) D8.3(VSS) D9.3(VSS) D10.3(VSS) D11.3(VSS) D12.3(VSS) D13.3(VSS) D14.3(VSS) D15.3(VSS) D16.3(VSS) D17.3(VSS)
NetD6_4: D6.4(DIN) D9.2(DOUT)
NetD7_2: D7.2(DOUT) D8.4(DIN)
NetD7_4: D7.4(DIN) R43.2
NetD8_2: D8.2(DOUT) D10.4(DIN)
NetD9_4: D9.4(DIN) D11.2(DOUT)
NetD10_2: D10.2(DOUT) D12.4(DIN)
NetD11_4: D11.4(DIN) D13.2(DOUT)
NetD12_2: D12.2(DOUT) D14.4(DIN)
NetD13_4: D13.4(DIN) D15.2(DOUT)
NetD14_2: D14.2(DOUT) D16.4(DIN)
NetD15_4: D15.4(DIN) D17.2(DOUT)
NetD16_2: D16.2(DOUT) D17.4(DIN)
NetR43_1: R43.1 X41.1
NetX9_1: X41.2 ; port PB0

Not connected (* = marked no-connect by the designer): D6 2(DOUT)

### Notes on the sheet
- EURO-Platine
- Diplomarbeit 2017/18 4BHEL
- 7
- Ver. 2.1
- Schuh Kevin

### Library data of the parts
C37-C48 = Cap_Keramik_SMD: Capacitor_SMD; Published: 8-Jun-2000; LatestRevisionDate: 17-Jul-2002; LatestRevisionNote: Re-released for DXP Platform.; PackageReference: RAD-0.3; Publisher: Altium Limited
R43 = Res_SMD: Resistor; Published: 8-Jun-2000; LatestRevisionDate: 17-Jul-2002; LatestRevisionNote: Re-released for DXP Platform.; PackageReference: AXIAL-0.4; Publisher: Altium Limited
X41 X42 = Header_2: Header, 2-Pin; LatestRevisionDate: 17-Jul-2002; LatestRevisionNote: Re-released for DXP Platform.; Publisher: Altium Limited
D6-D17 = WS2812B: LatestRevisionDate: 17-Jul-2002; LatestRevisionNote: Re-released for DXP Platform.; Publisher: Altium Limited

## Nets that join several sheets
+3.3V: ARM_EURO_Platine1 (7 pins), ARM_EURO_Platine2 (9 pins), ARM_EURO_Platine3 (5 pins), ARM_EURO_Platine4 (8 pins), ARM_EURO_Platine5 (17 pins)
+5V: ARM_EURO_Platine1 (7 pins), ARM_EURO_Platine2 (B3.2 B4.1 C6.2), ARM_EURO_Platine3 (C7.2 D2.4 D2.8 R11.1), ARM_EURO_Platine4 (V16.1 X20.25 X24.1), ARM_EURO_Platine5 (5 pins), ARM_EURO_Platine6 (7 pins), ARM_EURO_Platine7 (X42.1)
GND: ARM_EURO_Platine1 (31 pins), ARM_EURO_Platine2 (12 pins), ARM_EURO_Platine3 (18 pins), ARM_EURO_Platine4 (15 pins), ARM_EURO_Platine5 (16 pins), ARM_EURO_Platine6 (21 pins), ARM_EURO_Platine7 (24 pins)
NetA2_2: ARM_EURO_Platine5 (A2.2 X35.1), ARM_EURO_Platine6 (C23.2 C31.2 R39.1)
NetA2_3: ARM_EURO_Platine5 (A2.3 X35.5), ARM_EURO_Platine6 (C25.2 C33.2 R40.1)
NetC5_2: ARM_EURO_Platine5 (X28.3 X31.1), ARM_EURO_Platine6 (C5.2 C27.2 R37.1)
NetC9_1: ARM_EURO_Platine3 (C9.1 R12.2 S1.7), ARM_EURO_Platine4 (X20.30)
NetC10_1: ARM_EURO_Platine3 (C10.1 R15.2 S1.1), ARM_EURO_Platine4 (X20.12), ARM_EURO_Platine5 (X30.3)
NetC11_1: ARM_EURO_Platine3 (C11.1 R16.2 S1.3), ARM_EURO_Platine4 (X20.38)
NetC20_2: ARM_EURO_Platine1 (X37.4), ARM_EURO_Platine4 (X20.20), ARM_EURO_Platine5 (X32.3 X33.17), ARM_EURO_Platine6 (C20.2 C28.2 R37.2)
NetC21_2: ARM_EURO_Platine5 (X28.4 X31.2), ARM_EURO_Platine6 (C21.2 C29.2 R38.1)
NetC22_2: ARM_EURO_Platine1 (X37.2), ARM_EURO_Platine4 (X20.19), ARM_EURO_Platine5 (X32.4), ARM_EURO_Platine6 (C22.2 C30.2 R38.2)
NetC24_2: ARM_EURO_Platine3 (X17.3), ARM_EURO_Platine4 (S2.4 X20.50), ARM_EURO_Platine5 (X33.15 X34.3), ARM_EURO_Platine6 (C24.2 C32.2 R39.2)
NetC26_2: ARM_EURO_Platine3 (X17.1), ARM_EURO_Platine4 (S2.3 X20.49), ARM_EURO_Platine5 (X33.16 X34.4), ARM_EURO_Platine6 (C26.2 C34.2 R40.2)
NetD2_3: ARM_EURO_Platine2 (X9.12), ARM_EURO_Platine3 (D2.3)
NetD4_9: ARM_EURO_Platine2 (X10.4 X13.4), ARM_EURO_Platine4 (X20.37 X24.4), ARM_EURO_Platine5 (R29.1 X26.4 X33.31), ARM_EURO_Platine6 (D4.9)
NetD4_11: ARM_EURO_Platine2 (X10.2 X13.2), ARM_EURO_Platine4 (X20.36 X24.3), ARM_EURO_Platine5 (R30.1 X26.3 X33.32), ARM_EURO_Platine6 (D4.11)
NetR1_2: ARM_EURO_Platine1 (R1.2), ARM_EURO_Platine4 (X20.21)
NetR2_2: ARM_EURO_Platine1 (R2.2), ARM_EURO_Platine4 (X20.22)
NetR20_2: ARM_EURO_Platine4 (R20.2 X20.44), ARM_EURO_Platine5 (X33.13)
NetR21_2: ARM_EURO_Platine4 (R21.2 X20.45), ARM_EURO_Platine5 (X33.11)
NetR22_2: ARM_EURO_Platine4 (R22.2 X20.46), ARM_EURO_Platine5 (X33.9)
NetR23_2: ARM_EURO_Platine4 (R23.2 X20.5), ARM_EURO_Platine5 (X33.10)
NetR24_2: ARM_EURO_Platine4 (R24.2 X20.6), ARM_EURO_Platine5 (X33.12)
NetR25_2: ARM_EURO_Platine4 (R25.2 X20.15), ARM_EURO_Platine5 (X33.23)
NetR26_2: ARM_EURO_Platine4 (R26.2 X20.16), ARM_EURO_Platine5 (X33.25)
NetR27_2: ARM_EURO_Platine1 (X4.1), ARM_EURO_Platine4 (R27.2 X20.17), ARM_EURO_Platine5 (X33.21)
NetR47_1: ARM_EURO_Platine4 (X20.10 X24.8), ARM_EURO_Platine5 (R47.1 X30.1)
NetR48_1: ARM_EURO_Platine4 (X20.13 X24.10), ARM_EURO_Platine5 (R48.1 X30.4)
NetS2_1: ARM_EURO_Platine4 (S2.1 X20.47), ARM_EURO_Platine5 (X33.18)
NetS2_5: ARM_EURO_Platine4 (S2.5 X20.2), ARM_EURO_Platine5 (X33.28 X33.34)
NetS2_6: ARM_EURO_Platine4 (S2.6 X20.3), ARM_EURO_Platine5 (X33.27 X33.35)
NetS2_7: ARM_EURO_Platine4 (S2.7 X20.4), ARM_EURO_Platine5 (X33.26 X33.37)
NetS2_8: ARM_EURO_Platine4 (S2.8 X20.18), ARM_EURO_Platine5 (X33.22)
NetX9_1: ARM_EURO_Platine2 (6 pins), ARM_EURO_Platine4 (X20.7), ARM_EURO_Platine7 (X41.2)
NetX11_1: ARM_EURO_Platine2 (X11.1 X11.3), ARM_EURO_Platine4 (X20.35), ARM_EURO_Platine5 (X33.19)
NetX17_5: ARM_EURO_Platine3 (X17.5), ARM_EURO_Platine4 (X20.41)
NetX19_3: ARM_EURO_Platine4 (X19.3 X20.34), ARM_EURO_Platine5 (X33.20)
NetX19_15: ARM_EURO_Platine4 (X19.15 X20.42), ARM_EURO_Platine5 (X33.3 X33.33 X35.3)
NetX20_8: ARM_EURO_Platine4 (X20.8), ARM_EURO_Platine5 (X25.2 X36.4)
NetX20_9: ARM_EURO_Platine4 (X20.9), ARM_EURO_Platine5 (X25.3 X36.3)
NetX20_11: ARM_EURO_Platine4 (X20.11 X24.9), ARM_EURO_Platine5 (X30.2)
NetX20_32: ARM_EURO_Platine2 (X40.1), ARM_EURO_Platine4 (X20.32)
NetX20_39: ARM_EURO_Platine4 (X20.39), ARM_EURO_Platine5 (X33.24)
NetX20_43: ARM_EURO_Platine4 (X20.43), ARM_EURO_Platine5 (X33.14)